# Altium schematic sheet spartan6.SchDoc: Spartan-6 FPGA
size B; Engineer: A. Peck; Organization: UCLA High Energy Physics; DocumentNumber: 4; Revision: 3.0; SheetNumber: 4; SheetTotal: 15; Project: LCT Comparator Tester
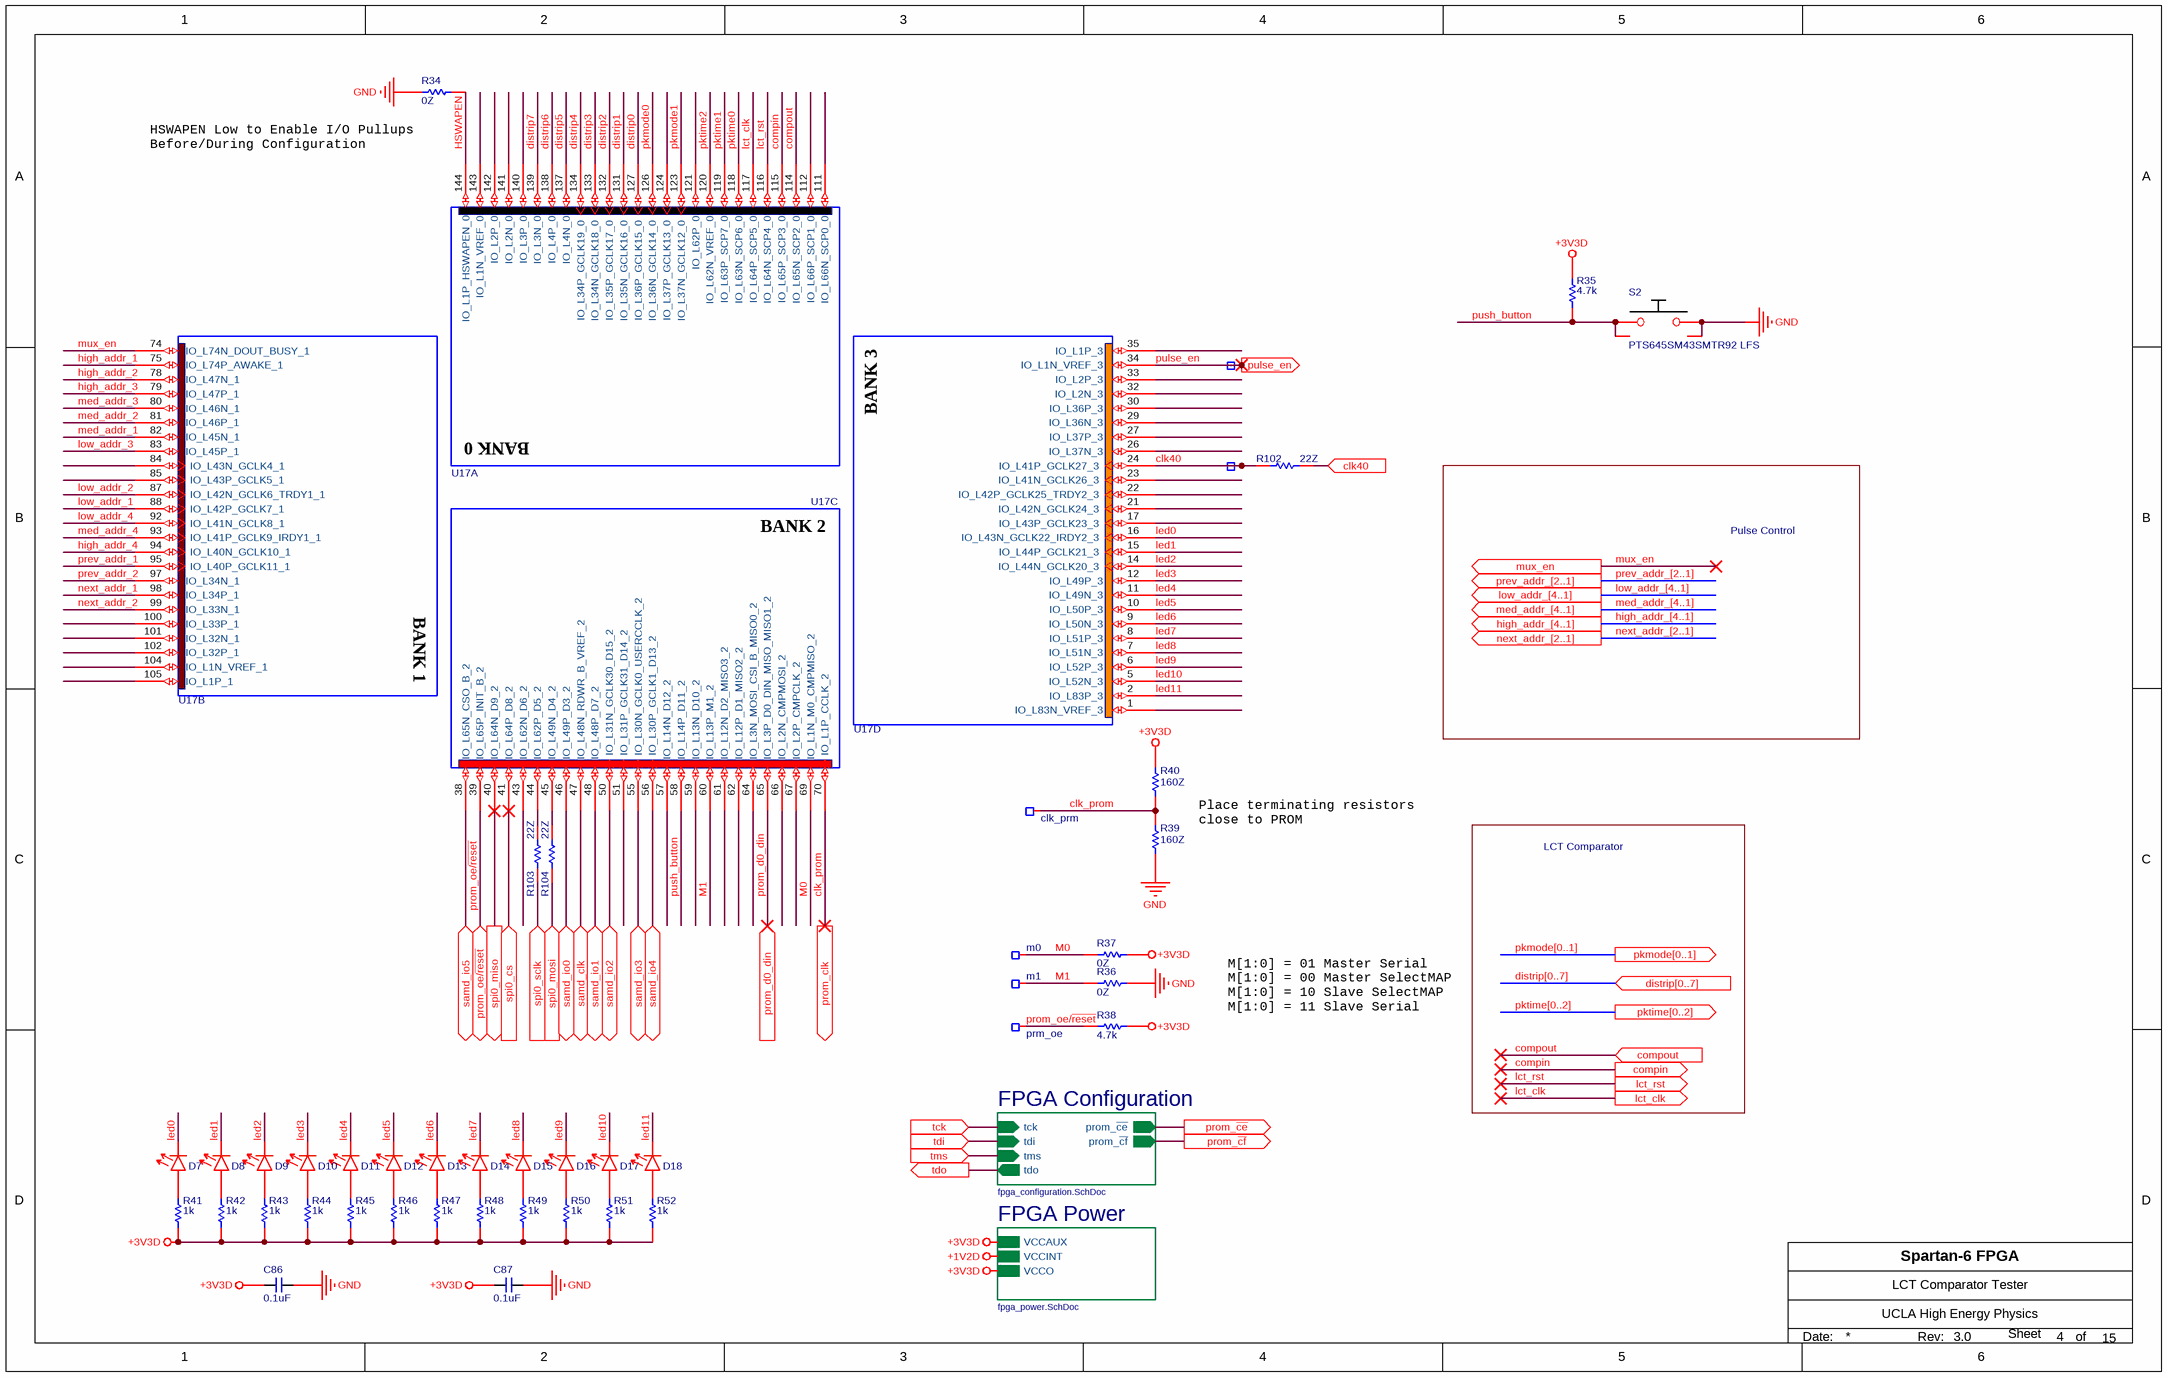
[diagram p0: spartan6.SchDoc]

## Parts
C86  0.1uF  [C0603]
C87  0.1uF  [C0603]
D7  Vishay/TLMS1000-GS08  [LED0603]  (value not drawn)
D8  Vishay/TLMS1000-GS08  [LED0603]  (value not drawn)
D9  Vishay/TLMS1000-GS08  [LED0603]  (value not drawn)
D10  Vishay/TLMS1000-GS08  [LED0603]  (value not drawn)
D11  Vishay/TLMS1000-GS08  [LED0603]  (value not drawn)
D12  Vishay/TLMS1000-GS08  [LED0603]  (value not drawn)
D13  Vishay/TLMS1000-GS08  [LED0603]  (value not drawn)
D14  Vishay/TLMS1000-GS08  [LED0603]  (value not drawn)
D15  Vishay/TLMS1000-GS08  [LED0603]  (value not drawn)
D16  Vishay/TLMS1000-GS08  [LED0603]  (value not drawn)
D17  Vishay/TLMS1000-GS08  [LED0603]  (value not drawn)
D18  Vishay/TLMS1000-GS08  [LED0603]  (value not drawn)
R34  0Z  [R0603]
R35  4.7k  [R0603]
R36  0Z  [R0603]
R37  0Z  [R0603]
R38  4.7k  [R0603]
R39  160Z  [R0603]
R40  160Z  [R0603]
R41  1k  [R0603]
R42  1k  [R0603]
R43  1k  [R0603]
R44  1k  [R0603]
R45  1k  [R0603]
R46  1k  [R0603]
R47  1k  [R0603]
R48  1k  [R0603]
R49  1k  [R0603]
R50  1k  [R0603]
R51  1k  [R0603]
R52  1k  [R0603]
R102  22Z  [R0402]
R103  22Z  [R0402]
R104  22Z  [R0402]
S2  PTS645SM43SMTR92 LFS  [C&K PTS645]
TP22  pulse_en  [TP_MICRO]  (value not drawn)  (no BOM)
TP23  m1  [TP_MICRO]  (no BOM)
TP24  m0  [TP_MICRO]  (no BOM)
TP25  prm_oe  [TP_MICRO]  (no BOM)
TP26  clk_prm  [TP_MICRO]  (no BOM)
TP32  clk40  [TP_MICRO]  (value not drawn)  (no BOM)
U17  XC6SLX4-2TQG144C  [TQFP-144]  (value not drawn)  (parts A,B,C,D of 7)

## Sub-sheets
FPGA Configuration = fpga_configuration.SchDoc: prom_~{ce} (out), prom_~{cf} (out), tck (in), tdi (in), tdo (out), tms (in)
FPGA Power = fpga_power.SchDoc: VCCAUX, VCCINT, VCCO

## Ports
clk40 (in), compin (out), compout (in), distrip[0..7] (in), high_addr_[4..1] (out), lct_clk (out), lct_rst (out), low_addr_[4..1] (out), med_addr_[4..1] (out), mux_en (out), next_addr_[2..1] (out), pkmode[0..1] (out), pktime[0..2] (out), prev_addr_[2..1] (out), prom_clk (out), prom_d0_din (in), prom_oe/~{reset} (bidir), prom_~{ce} (out), prom_~{cf} (out), pulse_en (out), samd_clk (bidir), samd_io0 (bidir), samd_io1 (bidir), samd_io2 (bidir), samd_io3 (bidir), samd_io4 (bidir), samd_io5 (bidir), spi0_cs (in), spi0_miso (out), spi0_mosi (in), spi0_sclk (in), tck (in), tdi (in), tdo (out), tms (in)

## Nets
+1V2D: sheet FPGA Power/VCCINT
+3V3D: C86.1 C87.1 R35.2 R37.2 R38.2 R40.1 R41.1 R42.1 R43.1 R44.1 R45.1 R46.1 R47.1 R48.1 R49.1 R50.1 R51.1 R52.1 ; sheet FPGA Power/VCCAUX, sheet FPGA Power/VCCO
GND: C86.2 C87.2 R34.1 R36.2 R39.1 S2.3 S2.4
clk40: R102.1 TP32.1 U17.24(IO_L41P_GCLK27_3)
clk40: R102.2 ; port clk40  [a separate net that carries the same name]
clk_prom: R39.2 R40.2 TP26.1 U17.70(IO_L1P_CCLK_2) ; port prom_clk
compin: U17.115(IO_L65P_SCP3_0) ; port compin
compout: U17.114(IO_L65N_SCP2_0) ; port compout
distrip0: U17.127(IO_L36P_GCLK15_0)
distrip1: U17.131(IO_L35N_GCLK16_0)
distrip2: U17.132(IO_L35P_GCLK17_0)
distrip3: U17.133(IO_L34N_GCLK18_0)
distrip4: U17.134(IO_L34P_GCLK19_0)
distrip5: U17.137(IO_L4N_0)
distrip6: U17.138(IO_L4P_0)
distrip7: U17.139(IO_L3N_0)
high_addr_1: U17.75(IO_L74P_AWAKE_1)
high_addr_2: U17.78(IO_L47N_1)
high_addr_3: U17.79(IO_L47P_1)
high_addr_4: U17.94(IO_L40N_GCLK10_1)
HSWAPEN: R34.2 U17.144(IO_L1P_HSWAPEN_0)
lct_clk: U17.117(IO_L64P_SCP5_0) ; port lct_clk
lct_rst: U17.116(IO_L64N_SCP4_0) ; port lct_rst
led0: D7.C U17.16(IO_L43N_GCLK22_IRDY2_3)
led1: D8.C U17.15(IO_L44P_GCLK21_3)
led2: D9.C U17.14(IO_L44N_GCLK20_3)
led3: D10.C U17.12(IO_L49P_3)
led4: D11.C U17.11(IO_L49N_3)
led5: D12.C U17.10(IO_L50P_3)
led6: D13.C U17.9(IO_L50N_3)
led7: D14.C U17.8(IO_L51P_3)
led8: D15.C U17.7(IO_L51N_3)
led9: D16.C U17.6(IO_L52P_3)
led10: D17.C U17.5(IO_L52N_3)
led11: D18.C U17.2(IO_L83P_3)
low_addr_1: U17.88(IO_L42P_GCLK7_1)
low_addr_2: U17.87(IO_L42N_GCLK6_TRDY1_1)
low_addr_3: U17.83(IO_L45P_1)
low_addr_4: U17.92(IO_L41N_GCLK8_1)
M0: R37.1 TP24.1 U17.69(IO_L1N_M0_CMPMISO_2)
M1: R36.1 TP23.1 U17.60(IO_L13P_M1_2)
med_addr_1: U17.82(IO_L45N_1)
med_addr_2: U17.81(IO_L46P_1)
med_addr_3: U17.80(IO_L46N_1)
med_addr_4: U17.93(IO_L41P_GCLK9_IRDY1_1)
mux_en: U17.74(IO_L74N_DOUT_BUSY_1) ; port mux_en
next_addr_1: U17.98(IO_L34P_1)
next_addr_2: U17.99(IO_L33N_1)
pkmode0: U17.126(IO_L36N_GCLK14_0)
pkmode1: U17.123(IO_L37N_GCLK12_0)
pktime0: U17.118(IO_L63N_SCP6_0)
pktime1: U17.119(IO_L63P_SCP7_0)
pktime2: U17.120(IO_L62N_VREF_0)
prev_addr_1: U17.95(IO_L40P_GCLK11_1)
prev_addr_2: U17.97(IO_L34N_1)
prom_~{ce}: port prom_~{ce}, sheet FPGA Configuration/prom_~{ce}
prom_~{cf}: port prom_~{cf}, sheet FPGA Configuration/prom_~{cf}
prom_d0_din: U17.65(IO_L3P_D0_DIN_MISO_MISO1_2) ; port prom_d0_din
prom_oe/~{reset}: R38.1 TP25.1 U17.39(IO_L65P_INIT_B_2) ; port prom_oe/~{reset}
pulse_en: TP22.1 U17.34(IO_L1N_VREF_3) ; port pulse_en
push_button: R35.1 S2.1 S2.2 U17.58(IO_L14P_D11_2)
samd_clk: U17.47(IO_L48N_RDWR_B_VREF_2) ; port samd_clk
samd_io0: U17.46(IO_L49P_D3_2) ; port samd_io0
samd_io1: U17.48(IO_L48P_D7_2) ; port samd_io1
samd_io2: U17.50(IO_L31N_GCLK30_D15_2) ; port samd_io2
samd_io3: U17.55(IO_L30N_GCLK0_USERCCLK_2) ; port samd_io3
samd_io4: U17.56(IO_L30P_GCLK1_D13_2) ; port samd_io4
samd_io5: U17.38(IO_L65N_CSO_B_2) ; port samd_io5
spi0_cs: U17.41(IO_L64P_D8_2) ; port spi0_cs
spi0_miso: U17.40(IO_L64N_D9_2) ; port spi0_miso
spi0_mosi: R104.1 ; port spi0_mosi
spi0_sclk: R103.1 ; port spi0_sclk
tck: port tck, sheet FPGA Configuration/tck
tdi: port tdi, sheet FPGA Configuration/tdi
tdo: port tdo, sheet FPGA Configuration/tdo
tms: port tms, sheet FPGA Configuration/tms
NetD7_A: D7.A R41.2
NetD8_A: D8.A R42.2
NetD9_A: D9.A R43.2
NetD10_A: D10.A R44.2
NetD11_A: D11.A R45.2
NetD12_A: D12.A R46.2
NetD13_A: D13.A R47.2
NetD14_A: D14.A R48.2
NetD15_A: D15.A R49.2
NetD16_A: D16.A R50.2
NetD17_A: D17.A R51.2
NetD18_A: D18.A R52.2
NetR103_2: R103.2 U17.44(IO_L62P_D5_2)
NetR104_2: R104.2 U17.45(IO_L49N_D4_2)

Not connected (* = marked no-connect by the designer): U17 1(IO_L83N_VREF_3) 17(IO_L43P_GCLK23_3) 21(IO_L42N_GCLK24_3) 22(IO_L42P_GCLK25_TRDY2_3) 23(IO_L41N_GCLK26_3) 26(IO_L37N_3) 27(IO_L37P_3) 29(IO_L36N_3) 30(IO_L36P_3) 32(IO_L2N_3) 33(IO_L2P_3) 35(IO_L1P_3) 43(IO_L62N_D6_2) 51(IO_L31P_GCLK31_D14_2) 57(IO_L14N_D12_2) 59(IO_L13N_D10_2) 61(IO_L12N_D2_MISO3_2) 62(IO_L12P_D1_MISO2_2) 64(IO_L3N_MOSI_CSI_B_MISO0_2) 66(IO_L2N_CMPMOSI_2) 67(IO_L2P_CMPCLK_2) 84(IO_L43N_GCLK4_1) 85(IO_L43P_GCLK5_1) 100(IO_L33P_1) 101(IO_L32N_1) 102(IO_L32P_1) 104(IO_L1N_VREF_1) 105(IO_L1P_1) 111(IO_L66N_SCP0_0) 112(IO_L66P_SCP1_0) 121(IO_L62P_0) 124(IO_L37P_GCLK13_0) 140(IO_L3P_0) 141(IO_L2N_0) 142(IO_L2P_0) 143(IO_L1N_VREF_0)

## Buses and harness runs
bus distrip[0..7] = port distrip[0..7]
bus high_addr_[4..1] = port high_addr_[4..1]
bus low_addr_[4..1] = port low_addr_[4..1]
bus med_addr_[4..1] = port med_addr_[4..1]
bus next_addr_[2..1] = port next_addr_[2..1]
bus pkmode[0..1] = port pkmode[0..1]
bus pktime[0..2] = port pktime[0..2]
bus prev_addr_[2..1] = port prev_addr_[2..1]

## Notes on the sheet
- HSWAPEN Low to Enable I/O Pullups Before/During Configuration
- Pulse Control
- Place terminating resistors
  close to PROM
- LCT Comparator
- M[1:0] = 01 Master Serial
  M[1:0] = 00 Master SelectMAP
  M[1:0] = 10 Slave SelectMAP
  M[1:0] = 11 Slave Serial
- Date:
- Rev:
- of
- Sheet
- (in symbol Xilinx/FPGA-XSP6-XC6SLX9-SQ144, part A) BANK 0
- (in symbol Xilinx/FPGA-XSP6-XC6SLX9-SQ144, part B) BANK 1
- (in symbol Xilinx/FPGA-XSP6-XC6SLX9-SQ144, part C) BANK 2
- (in symbol Xilinx/FPGA-XSP6-XC6SLX9-SQ144, part D) BANK 3

## Library data of the parts
C86 C87 = CAP/06035C104KAT2A: CAP-CER, 2, 0.1uF, 10%, 50V, 0603, X7R; Manufacturer: AVX Corporation; Capacitance: 0.10µF; Supplier 1: Digi-Key; Manufacturer Part Number: 06035C104KAT2A; RoHS: RoHS Compliant; Category: Capacitors; Stock 1: 4412408; Pricing 1: 1=0.1, 10=0.036, 25=0.0264, 50=0.0198, 100=0.0162, 250=0.01352, 500=0.01156, 1000=0.00908 (USD); Packaging: Cut Tape (CT); Tolerance: ±10%; Voltage - Rated: 50V; Temperature Coefficient: X7R; Mounting Type: Surface Mount, MLCC; Operating Temperature: -55°C ~ 125°C; Applications: General Purpose; Ratings: -; Package / Case: 0603 (1608 Metric); Size / Dimension: 0.063" L x 0.032" W (1.60mm x 0.81mm); Height - Seated (Max): -; Thickness (Max): 0.035" (0.90mm); Lead Spacing: -; Features: -; Lead Style: -; ComponentLink1URL: http://datasheets.avx.com/X7RDielectric.pdf; ComponentLink1Description: http://datasheets.avx.com/X7RDielectric.pdf; Supplier 2: Newark; Supplier Part Number 1: 478-5052-1-ND; Supplier Part Number 2: 54K2412
D7-D18 = Vishay/TLMS1000-GS08: LED, 2mA, 0603, Red; Manufacturer: Vishay Semiconductor Opto Division; Millicandela Rating: 4mcd; Lens Style/Size: Rectangle with Flat Top, 1.60mm x 0.80mm; Voltage - Forward (Vf) (Typ): 1.8V; Viewing Angle: 160°; Wavelength - Dominant: 628nm; Wavelength - Peak: 640nm; Supplier 1: Digi-Key; Manufacturer Part Number: TLMS1000-GS08; RoHS: RoHS Compliant; Category: Optoelectronics; Stock 1: 12598; Pricing 1: 1=0.52, 10=0.372, 25=0.304, 100=0.2432, 250=0.20524, 500=0.17482, 1000=0.13682 (USD); Packaging: Cut Tape (CT); Color: Red; Lens Color: -; Lens Transparency: -; Current - Test: 2mA; Mounting Type: Surface Mount; Features: -; Package / Case: 0603 (1608 Metric); Supplier Device Package: 0603; Size / Dimension: 1.60mm L x 0.80mm W; Height (Max): 0.65mm; ComponentLink1URL: http://www.vishay.com/docs/83172/tlmo1000.pdf; ComponentLink1Description: http://www.vishay.com/docs/83172/tlmo1000.pdf; Supplier 2: Newark; Supplier Part Number 1: TLMS1000-GS08CT-ND; Supplier Part Number 2: 35M3052
R34 R36 R37 = CRCW06030000Z0EA: RES0, SMD, 0.00Z, 0603; Manufacturer: Vishay Dale; Resistance (Ohms): 0.0; Tolerance: Jumper; Power (Watts): 0.1W, 1/10W; Manufacturer Part Number: CRCW06030000Z0EA; RoHS: RoHS Compliant; Category: Resistors; Packaging: Cut Tape (CT); Composition: Thick Film; Features: Automotive AEC-Q200; Temperature Coefficient: -; Operating Temperature: -55°C ~ 155°C; Package / Case: 0603 (1608 Metric); Supplier Device Package: 0603; Size / Dimension: 0.061" L x 0.033" W (1.55mm x 0.85mm); Height: 0.020" (0.50mm); Number of Terminations: 2; ComponentLink1URL: http://www.vishay.com/docs/20035/dcrcwe3.pdf; ComponentLink1Description: http://www.vishay.com/docs/20035/dcrcwe3.pdf; Supplier 1: Digi-Key; Stock 1: 3403646; Pricing 1: 1=0.1, 10=0.022, 25=0.016, 50=0.0124, 100=0.0091, 250=0.00692, 500=0.00554, 1000=0.00408, 2500=0.00354 (USD); Supplier Part Number 1: 541-0.0GCT-ND; Supplier 2: Newark; Supplier Part Number 2: 52K8014
R35 R38 = CRCW06034K70FKEA: RES1, SMD, 4.70k, 1.0%, 1/10W, 0603; Manufacturer: Vishay Dale; Tolerance: ±1%; Power (Watts): 0.1W, 1/10W; Temperature Coefficient: ±100ppm/°C; Supplier 1: Digi-Key; Supplier Part Number 1: 541-4.70KHCT-ND; Manufacturer Part Number: CRCW06034K70FKEA; RoHS: RoHS Compliant; Category: Resistors; Packaging: Cut Tape (CT); Part Status: Active; Resistance (Ohms): 4.7k; Composition: Thick Film; Features: Automotive AEC-Q200; Operating Temperature: -55°C ~ 155°C; Package / Case: 0603 (1608 Metric); Supplier Device Package: 0603; Size / Dimension: 0.063" L x 0.033" W (1.60mm x 0.85mm); Height - Seated (Max): 0.020" (0.50mm); Number of Terminations: 2; Failure Rate: -; ComponentLink1URL: http://www.vishay.com/docs/20035/dcrcwe3.pdf; ComponentLink1Description: http://www.vishay.com/docs/20035/dcrcwe3.pdf; Stock 1: 413202; Pricing 1: 1=0.1, 10=0.03, 25=0.022, 50=0.0168, 100=0.0123, 250=0.0094, 500=0.00752, 1000=0.00554, 2500=0.00481 (USD)
R39 R40 = CRCW0603160RFKEA: RES0, SMD,  160Z, 1.0%, 1/10W, 0603; Manufacturer: Vishay Dale; Resistance (Ohms): 160; Tolerance: ±1%; Power (Watts): 0.1W, 1/10W; Temperature Coefficient: ±100ppm/°C; Supplier 1: Digi-Key; Manufacturer Part Number: CRCW0603160RFKEA; RoHS: RoHS Compliant; Category: Resistors; Stock 1: 48671; Pricing 1: 1=0.1, 10=0.03, 25=0.022, 50=0.0168, 100=0.0123, 250=0.0094, 500=0.00752, 1000=0.00554, 2500=0.00481 (USD); Packaging: Cut Tape (CT); Part Status: Active; Composition: Thick Film; Features: Automotive AEC-Q200; Operating Temperature: -55°C ~ 155°C; Package / Case: 0603 (1608 Metric); Supplier Device Package: 0603; Size / Dimension: 0.063" L x 0.033" W (1.60mm x 0.85mm); Height - Seated (Max): 0.020" (0.50mm); Number of Terminations: 2; Failure Rate: -; ComponentLink1URL: http://www.vishay.com/docs/20035/dcrcwe3.pdf; ComponentLink1Description: http://www.vishay.com/docs/20035/dcrcwe3.pdf; Supplier Part Number 1: 541-160HCT-ND
R41-R52 = CRCW06031K00FKEA: RES1, SMD, 1.00k, 1.0%, 1/10W, 0603; Manufacturer: Vishay Dale; Tolerance: ±1%; Power (Watts): 0.1W, 1/10W; Temperature Coefficient: ±100ppm/°C; Supplier 1: Digi-Key; Supplier Part Number 1: 541-1.00KHCT-ND; Manufacturer Part Number: CRCW06031K00FKEA; RoHS: RoHS Compliant; Category: Resistors; Stock 1: 770011; Pricing 1: 1=0.1, 10=0.03, 25=0.022, 50=0.0168, 100=0.0123, 250=0.0094, 500=0.00752, 1000=0.00554, 2500=0.00481 (USD); Packaging: Cut Tape (CT); Resistance (Ohms): 1k; Composition: Thick Film; Features: Automotive AEC-Q200; Operating Temperature: -55°C ~ 155°C; Package / Case: 0603 (1608 Metric); Supplier Device Package: 0603; Size / Dimension: 0.061" L x 0.033" W (1.55mm x 0.85mm); Height: 0.020" (0.50mm); Number of Terminations: 2; ComponentLink1URL: http://www.vishay.com/docs/20035/dcrcwe3.pdf; ComponentLink1Description: http://www.vishay.com/docs/20035/dcrcwe3.pdf; Supplier 2: Newark; Supplier Part Number 2: 52K8015
R102-R104 = RES/ 311-22.0LRCT-ND: RES0, SMD, 22.0Z, 1.0%, 1/16W, 0402; Manufacturer: Yageo; Manufacturer Part Number: RC0402FR-0722RL; Resistance (Ohms): 22; Tolerance: ±1%; Power (Watts): 0.063W, 1/16W; Temperature Coefficient: ±100ppm/°C; RoHS: RoHS Compliant; Category: Resistors; Packaging: Cut Tape (CT); Composition: Thick Film; Features: Moisture Resistant; Operating Temperature: -55°C ~ 155°C; Package / Case: 0402 (1005 Metric); Supplier Device Package: 0402; Size / Dimension: 0.039" L x 0.020" W (1.00mm x 0.50mm); Height: 0.016" (0.40mm); Number of Terminations: 2; ComponentLink1URL: http://www.yageo.com/documents/recent/PYu-RC_Group_51_RoHS_L_04.pdf; ComponentLink1Description: http://www.yageo.com/documents/recent/PYu-RC_Group_51_RoHS_L_04.pdf; Supplier 1: Digi-Key; Stock 1: 1724839; Pricing 1: 1=0.1, 10=0.013, 25=0.0096, 100=0.0054, 250=0.00412, 500=0.00328, 1000=0.00242, 2500=0.0021, 5000=0.00173 (USD); Supplier Part Number 1: 311-22.0LRCT-ND; Supplier 2: Newark; Supplier Part Number 2: 67R9912
S2 = C&K/PTS645SM43SMTR92 LFS: Button, Switch SPST-NO, PCB; Manufacturer: C&K Components; Switch Function: Off-Mom; Contact Rating @ Voltage: 0.05A @ 12VDC; Actuator Type: Standard; Actuator Height off PCB, from Pins: 4.30mm; Actuator Orientation: Top Actuated; Outline: 6.00mm x 6.00mm; Illumination: Non-Illuminated; Operating Force: 160gf; Actuator Material: Polyamide (PA66), Nylon 6/6; Mechanical Life: 100,000 Cycles; Supplier 1: Digi-Key; Manufacturer Part Number: PTS645SM43SMTR92 LFS; RoHS: RoHS Compliant; Category: Switches; Stock 1: 434807; Pricing 1: 1=0.17, 10=0.161, 25=0.156, 50=0.1502, 100=0.1419, 250=0.1336, 500=0.12802 (USD); Packaging: Cut Tape (CT); Part Status: Active; Circuit: SPST-NO; Mounting Type: Surface Mount; Termination Style: Gull Wing; Illumination Voltage (Nominal): -; Illumination Type, Color: -; Ingress Protection: -; Features: Blue Actuator; Switch Travel: -; Operating Temperature: -20°C ~ 60°C; ComponentLink1URL: http://media.digikey.com/pdf/Data%20Sheets/C&K/PTS645_Series.pdf; ComponentLink1Description: http://media.digikey.com/pdf/Data%20Sheets/C&K/PTS645_Series.pdf; Supplier Part Number 1: CKN9112CT-ND
TP22-TP26 TP32 = TP_MICRO: Test Point, Round, Small
U17 = Xilinx/FPGA-XSP6-XC6SLX9-SQ144: FPGA, Spartan-6 LX 1.2V, 102 User I/Os, 144-Pin TQFP (0.5mm Pitch), Speed Grade 2, Commercial Grade, Pb-Free; PackageReference: TQG144; Code_JEDEC: MS-026-BFB; DatasheetVersion: ver1.6, Nov-2010; PackageVersion: ver1.2, Jun-2004; PackageDescription: 144-Pin Thin Quad Flat Pack (TQG144) - Pb-Free; Supplier 1: Digi-Key; Supplier Part Number 1: 122-1734-ND